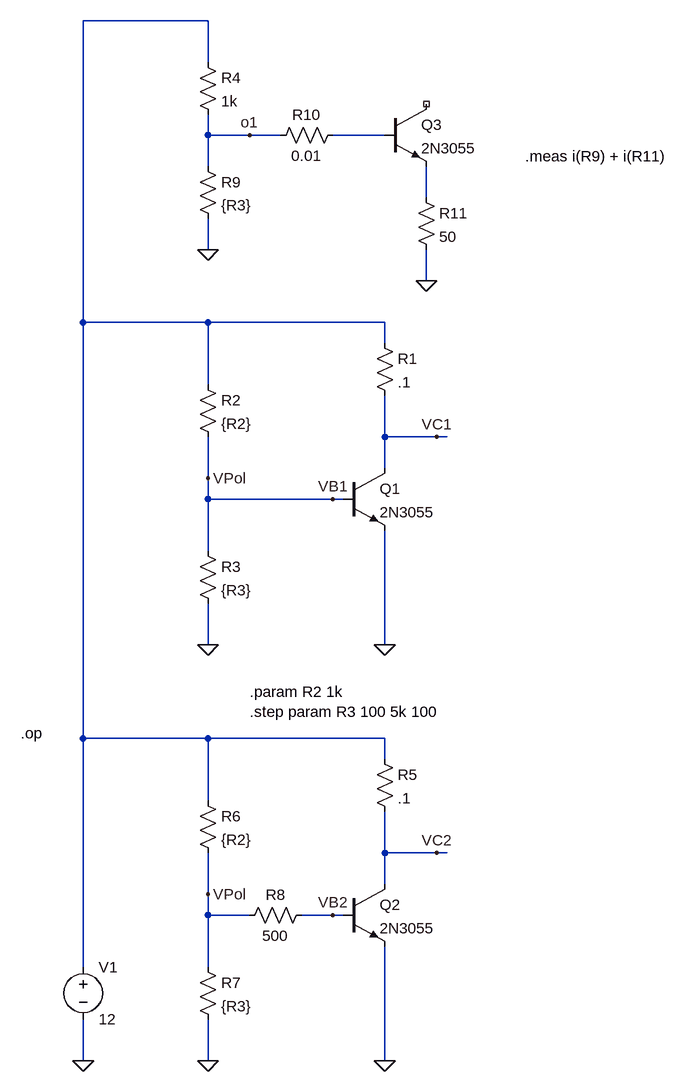
[diagram p0: schematic npnBasics.asc]
npnBasics.asc, the LTspice schematic file:
Version 4.1
SHEET 1 956 1076
WIRE 224 -544 32 -544
WIRE 224 -480 224 -544
WIRE 224 -368 224 -400
WIRE 288 -368 224 -368
WIRE 336 -368 288 -368
WIRE 496 -368 416 -368
WIRE 224 -320 224 -368
WIRE 560 -272 560 -320
WIRE 224 -192 224 -240
WIRE 560 -144 560 -192
WIRE 32 -80 32 -544
WIRE 224 -80 32 -80
WIRE 496 -80 224 -80
WIRE 496 -48 496 -80
WIRE 224 16 224 -80
WIRE 496 96 496 32
WIRE 576 96 496 96
WIRE 592 96 576 96
WIRE 496 144 496 96
WIRE 224 160 224 96
WIRE 224 192 224 160
WIRE 416 192 224 192
WIRE 432 192 416 192
WIRE 224 272 224 192
WIRE 224 416 224 352
WIRE 496 416 496 240
WIRE 32 560 32 -80
WIRE 224 560 32 560
WIRE 496 560 224 560
WIRE 496 592 496 560
WIRE 224 656 224 560
WIRE 496 736 496 672
WIRE 576 736 496 736
WIRE 592 736 576 736
WIRE 496 784 496 736
WIRE 224 800 224 736
WIRE 224 832 224 800
WIRE 288 832 224 832
WIRE 416 832 368 832
WIRE 432 832 416 832
WIRE 32 912 32 560
WIRE 224 912 224 832
WIRE 32 1056 32 992
WIRE 224 1056 224 992
WIRE 496 1056 496 880
FLAG 496 416 0
FLAG 224 416 0
FLAG 32 1056 0
FLAG 576 96 VC1
FLAG 416 192 VB1
FLAG 224 160 VPol
FLAG 496 1056 0
FLAG 224 1056 0
FLAG 576 736 VC2
FLAG 416 832 VB2
FLAG 224 800 VPol
FLAG 224 -192 0
FLAG 288 -368 o1
FLAG 560 -144 0
SYMBOL voltage 32 896 R0
WINDOW 123 0 0 Left 0
WINDOW 39 0 0 Left 0
SYMATTR InstName V1
SYMATTR Value 12
SYMBOL npn 432 144 R0
SYMATTR InstName Q1
SYMATTR Value 2N3055
SYMBOL res 480 -64 R0
SYMATTR InstName R1
SYMATTR Value .1
SYMBOL res 208 0 R0
SYMATTR InstName R2
SYMATTR Value {R2}
SYMBOL res 208 256 R0
SYMATTR InstName R3
SYMATTR Value {R3}
SYMBOL npn 432 784 R0
SYMATTR InstName Q2
SYMATTR Value 2N3055
SYMBOL res 480 576 R0
SYMATTR InstName R5
SYMATTR Value .1
SYMBOL res 208 640 R0
SYMATTR InstName R6
SYMATTR Value {R2}
SYMBOL res 208 896 R0
SYMATTR InstName R7
SYMATTR Value {R3}
SYMBOL res 384 816 R90
WINDOW 0 0 56 VBottom 2
WINDOW 3 32 56 VTop 2
SYMATTR InstName R8
SYMATTR Value 500
SYMBOL res 208 -496 R0
SYMATTR InstName R4
SYMATTR Value 1k
SYMBOL res 208 -336 R0
SYMATTR InstName R9
SYMATTR Value {R3}
SYMBOL npn 496 -416 R0
SYMATTR InstName Q3
SYMATTR Value 2N3055
SYMBOL res 432 -384 R90
WINDOW 0 0 56 VBottom 2
WINDOW 3 32 56 VTop 2
SYMATTR InstName R10
SYMATTR Value 0.01
SYMBOL res 544 -288 R0
SYMATTR InstName R11
SYMATTR Value 50
TEXT -64 552 Left 2 !.op
TEXT 288 488 Left 2 !.param R2 1k\n.step param R3 100 5k 100
TEXT 712 -336 Left 2 !.meas i(R9) + i(R11)

The netlist it stands for:
* npnBasics.asc
V1 N001 0 12
Q1 VC1 VPol 0 0 2N3055
R1 N001 VC1 .1
R2 N001 VPol {R2}
R3 VPol 0 {R3}
Q2 VC2 VB2 0 0 2N3055
R5 N001 VC2 .1
R6 N001 VPol {R2}
R7 VPol 0 {R3}
R8 VB2 VPol 500
R4 N001 o1 1k
R9 o1 0 {R3}
Q3 NC_01 N002 N003 0 2N3055
R10 N002 o1 0.01
R11 N003 0 50
.model NPN NPN
.model PNP PNP
.lib standard.bjt
.op
.param R2 1k
.step param R3 100 5k 100
.meas i(R9) + i(R11)
.backanno
.end